# Altium schematic sheet Teensy.SchDoc
size A; SheetNumber: 5; SheetTotal: 6
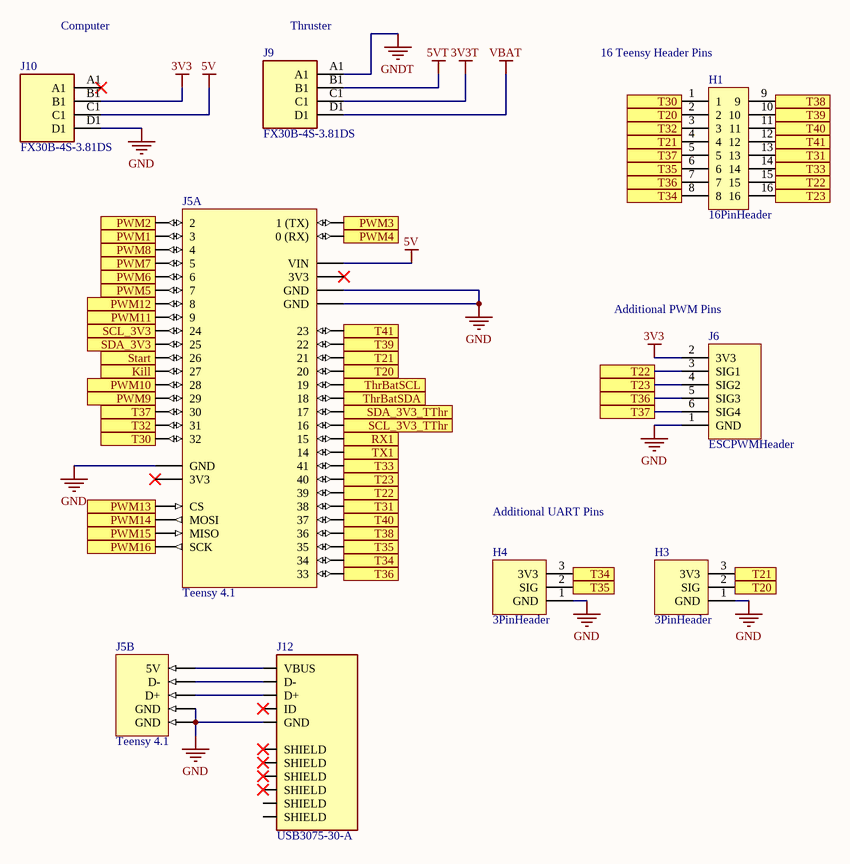
[diagram p0: Teensy.SchDoc]

## Parts
H1  16PinHeader  [67996-416HLF_AMP]
H3  3PinHeader  [SAMTEC-TSW-103-07-X-S]
H4  3PinHeader  [SAMTEC-TSW-103-07-X-S]
J5  Teensy 4.1  [Teensy4.1]  (parts A,B of 2)
J6  ESCPWMHeader  [CON12_3X4_TU_TSW_SAI]
J9  FX30B-4S-3.81DS  [FX30B4S381DS]
J10  FX30B-4S-3.81DS  [FX30B4S381DS]
J12  USB3075-30-A  [GCT_USB3075-30-A]

## Ports
Kill, PWM1, PWM2, PWM3, PWM4, PWM5, PWM6, PWM7, PWM8, PWM9, PWM10, PWM11, PWM12, PWM13, PWM14, PWM15, PWM16, RX1, SCL_3V3, SCL_3V3_TThr, SDA_3V3, SDA_3V3_TThr, Start, T20, T21, T22, T23, T30, T31, T32, T33, T34, T35, T36, T37, T38, T39, T40, T41, ThrBatSCL, ThrBatSDA, TX1

## Nets
3V3: J6.2(3V3) J10.B1
3V3T: J9.C1
5V: J5.48(VIN) J10.C1
5VT: J9.B1
GND: H3.1(GND) H4.1(GND) J5.1(GND) J5.34(GND) J5.47(GND) J5.49(GND) J5.50(GND) J6.1(GND) J10.D1 J12.5(GND)
GNDT: J9.A1
VBAT: J9.D1
Kill: J5.19(27) ; port Kill
PWM1: J5.5(3) ; port PWM1
PWM2: J5.4(2) ; port PWM2
PWM3: J5.3(1_(TX)) ; port PWM3
PWM4: J5.2(0_(RX)) ; port PWM4
PWM5: J5.9(7) ; port PWM5
PWM6: J5.8(6) ; port PWM6
PWM7: J5.7(5) ; port PWM7
PWM8: J5.6(4) ; port PWM8
PWM9: J5.21(29) ; port PWM9
PWM10: J5.20(28) ; port PWM10
PWM11: J5.11(9) ; port PWM11
PWM12: J5.10(8) ; port PWM12
PWM13: J5.12(CS) ; port PWM13
PWM14: J5.13(MOSI) ; port PWM14
PWM15: J5.14(MISO) ; port PWM15
PWM16: J5.35(SCK) ; port PWM16
RX1: J5.37(15) ; port RX1
SCL_3V3: J5.16(24) ; port SCL_3V3
SCL_3V3_TThr: J5.38(16) ; port SCL_3V3_TThr
SDA_3V3: J5.17(25) ; port SDA_3V3
SDA_3V3_TThr: J5.39(17) ; port SDA_3V3_TThr
Start: J5.18(26) ; port Start
T20: H1.2 H3.2(SIG) J5.42(20) ; port T20
T21: H1.4 H3.3(3V3) J5.43(21) ; port T21
T22: H1.15 J5.31(39) J6.3(SIG1) ; port T22
T23: H1.16 J5.32(40) J6.4(SIG2) ; port T23
T30: H1.1 J5.24(32) ; port T30
T31: H1.13 J5.30(38) ; port T31
T32: H1.3 J5.23(31) ; port T32
T33: H1.14 J5.33(41) ; port T33
T34: H1.8 H4.3(3V3) J5.26(34) ; port T34
T35: H1.6 H4.2(SIG) J5.27(35) ; port T35
T36: H1.7 J5.25(33) J6.5(SIG3) ; port T36
T37: H1.5 J5.22(30) J6.6(SIG4) ; port T37
T38: H1.9 J5.28(36) ; port T38
T39: H1.10 J5.44(22) ; port T39
T40: H1.11 J5.29(37) ; port T40
T41: H1.12 J5.45(23) ; port T41
ThrBatSCL: J5.41(19) ; port ThrBatSCL
ThrBatSDA: J5.40(18) ; port ThrBatSDA
TX1: J5.36(14) ; port TX1
NetJ5_51: J5.51(D+) J12.3(D+)
NetJ5_52: J5.52(D-) J12.2(D-)
NetJ5_53: J5.53(5V) J12.1(VBUS)

Not connected (* = marked no-connect by the designer): J5 15(3V3)* 46(3V3)*; J10 A1*; J12 4(ID)* S1(SHIELD)* S2(SHIELD)* S3(SHIELD)* S4(SHIELD)* S5(SHIELD) S6(SHIELD)

## Notes on the sheet
- Computer
- (near J9) Thruster
- (near H1) 16 Teensy Header Pins
- (near J6) Additional PWM Pins
- Additional UART Pins

## Library data of the parts
J5 = Teensy4.1
J6 = ESCPWMHeader: 4x3 Header Block; pin to pad: 1>1+4+7+10 2>2+5+8+11 4>6 5>9 6>12; Supplier 1: Digi-Key; Supplier Part Number 1: SAM12310-ND; Supplier 2: Digi-Key; Supplier Part Number 2: SAM8995-ND
J9 J10 = FX30B-4S-3.81DS: Connector; Manufacturer_Name: Hirose; Datasheet Link: https://www.hirose.com/product/download/?distributor=digikey&type=2d&lang=en&num=FX30B-4S-3.81DS; Height: 11.3mm; Manufacturer_Part_Number: FX30B-4S-3.81DS
J12 = USB3075-30-A: USB - micro B USB 2.0 Receptacle Connector 5 Position Surface Mount, Right Angle; Through Hole; MF: Global Connector Technology; SnapEDA_Link: https://www.snapeda.com/parts/USB3075-30-A/Global%20Connector%20Technology/view-part/229370/?ref=snap; Value: *; Digi-Key_Part_Number: 2073-USB3075-30-ACT-ND; MP: USB3075-30-A; Digi-Key_Purchase_URL: https://www.digikey.com/product-detail/en/gct/USB3075-30-A/2073-USB3075-30-ACT-ND/9859705?utm_source=snapeda&utm_medium=aggregator&utm_campaign=symbol; Package: None